# Altium project Payload Board.PrjPcb
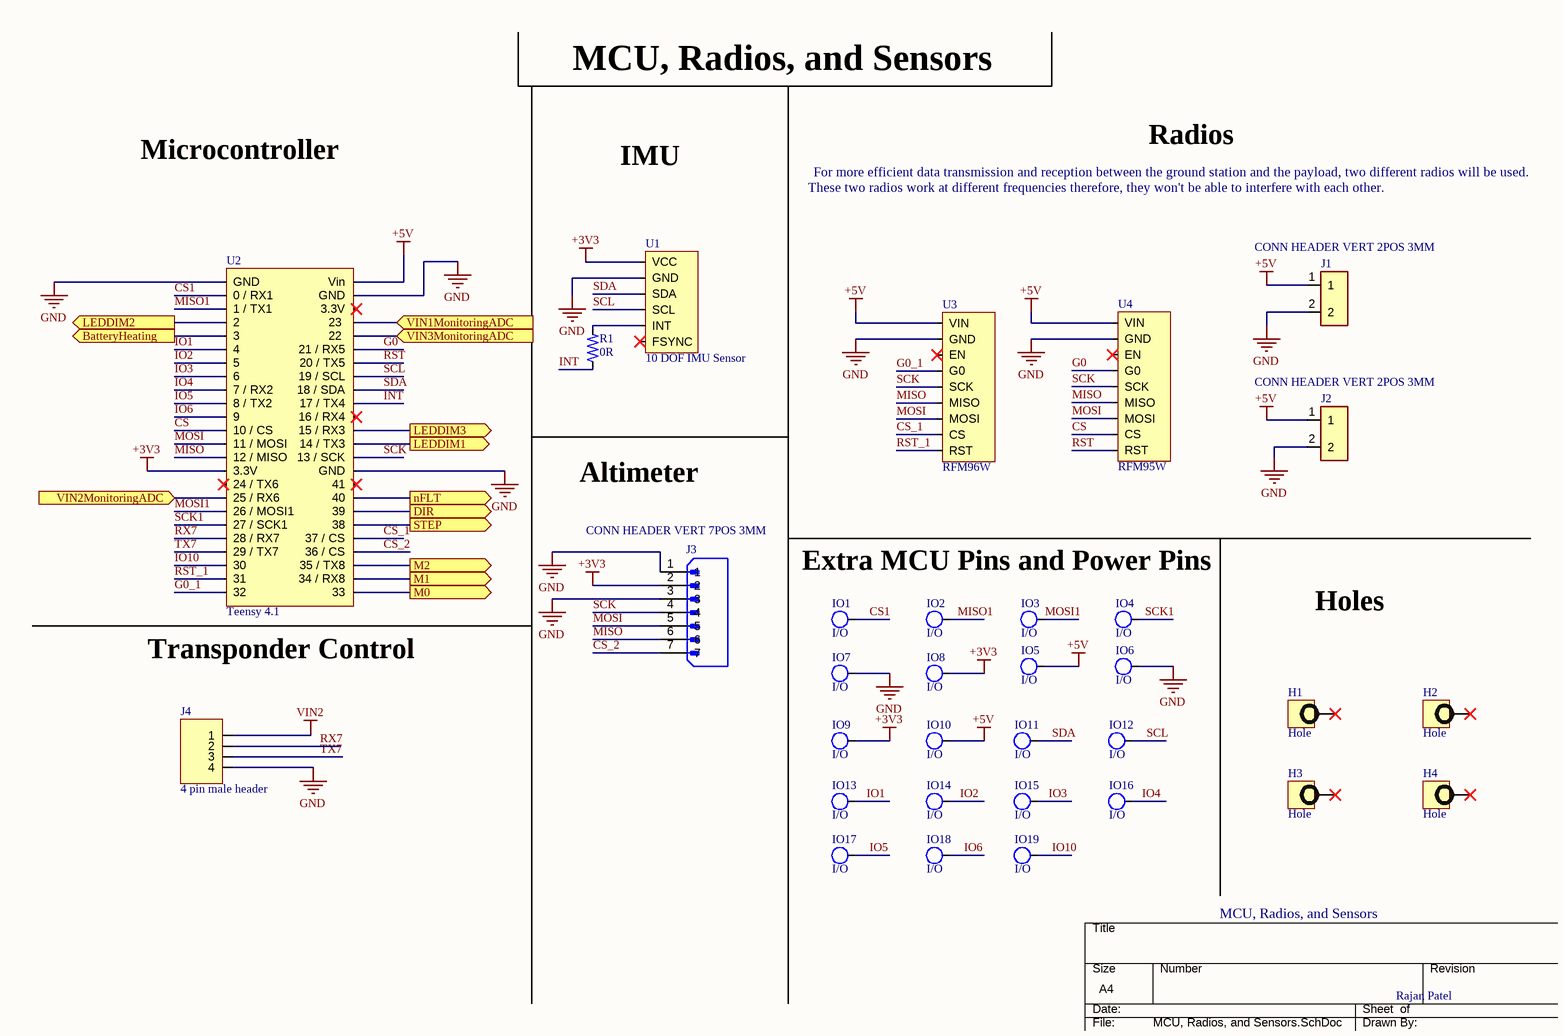
[diagram p0: MCU, Radios, and Sensors.SchDoc]
3 sheets, 75 parts. Net scope: flat (ports and power ports of the same name join across sheets).
Board file: Payload_PCB.PcbDoc
Sheets:
  MCU, Radios, and Sensors.SchDoc
  Battery Heating System.SchDoc
  Power Management.SchDoc

## Sheet MCU, Radios, and Sensors.SchDoc: MCU, Radios, and Sensors
size A4; SheetNumber: 1; SheetTotal: 4

### Parts
H1  Hole  [M3 Holes]
H2  Hole  [M3 Holes]
H3  Hole  [M3 Holes]
H4  Hole  [M3 Holes]
IO1  I/O  [Pins]
IO2  I/O  [Pins]
IO3  I/O  [Pins]
IO4  I/O  [Pins]
IO5  I/O  [Pins]
IO6  I/O  [Pins]
IO7  I/O  [Pins]
IO8  I/O  [Pins]
IO9  I/O  [Pins]
IO10  I/O  [Pins]
IO11  I/O  [Pins]
IO12  I/O  [Pins]
IO13  I/O  [Pins]
IO14  I/O  [Pins]
IO15  I/O  [Pins]
IO16  I/O  [Pins]
IO17  I/O  [Pins]
IO18  I/O  [Pins]
IO19  I/O  [Pins]
J1  CONN HEADER VERT 2POS 3MM  [CONN HEADER VERT 2POS 3MM]
J2  CONN HEADER VERT 2POS 3MM  [CONN HEADER VERT 2POS 3MM]
J3  CONN HEADER VERT 7POS 3MM  [MOLEX_436500728]
J4  4 pin male header  [4 Pin Male Header]
R1  0R  [res 0805]
U1  10 DOF IMU Sensor  [10 DOF IMU Sensor]
U2  Teensy 4.1  [Teensy 4.1]
U3  RFM96W  [RFM95W]
U4  RFM95W  [RFM95W]

### Ports
BatteryHeating (out, see Battery Heating System[2B]), DIR (out, see LEDs, and Motors[3B]), LEDDIM1 (out, see LEDs, and Motors[1B]), LEDDIM2 (out, see LEDs, and Motors[2B]), LEDDIM3 (out, see LEDs, and Motors[1C]), M0 (out, see LEDs, and Motors[3B]), M1 (out, see LEDs, and Motors[3B]), M2 (out, see LEDs, and Motors[3B]), nFLT (out, see LEDs, and Motors[3B]), STEP (out, see LEDs, and Motors[3B]), VIN1MonitoringADC (in, see Power Management[1B]), VIN2MonitoringADC (in, see Power Management[3B]), VIN3MonitoringADC (in, see Power Management[4C])

### Nets
+3V3: IO8.1 IO9.1 J3.2 U1.1(VCC) U2.15(3.3V)
+5V: IO5.1 IO10.1 J1.1 J2.1 U2.48(Vin) U3.1(VIN) U4.1(VIN)
GND: IO6.1 IO7.1 J1.2 J2.2 J3.1 J3.3 J4.4 U1.2(GND) U2.1(GND) U2.34(GND) U2.47(GND) U3.2(GND) U4.2(GND)
VIN2: J4.1
CS: U2.12(10_/_CS) U4.8(CS)
CS1: IO1.1 U2.2(0_/_RX1)
CS_1: U2.29(37_/_CS) U3.8(CS)
CS_2: J3.7 U2.28(36_/_CS)
G0: U2.43(21_/_RX5) U4.4(G0)
G0_1: U2.24(32) U3.4(G0)
INT: R1.1 U2.39(17_/_TX4)
IO1: IO13.1 U2.6(4)
IO2: IO14.1 U2.7(5)
IO3: IO15.1 U2.8(6)
IO4: IO16.1 U2.9(7_/_RX2)
IO5: IO17.1 U2.10(8_/_TX2)
IO6: IO18.1 U2.11(9)
IO10: IO19.1 U2.22(30)
MISO: J3.6 U2.14(12_/_MISO) U3.6(MISO) U4.6(MISO)
MISO1: IO2.1 U2.3(1_/_TX1)
MOSI: J3.5 U2.13(11_/_MOSI) U3.7(MOSI) U4.7(MOSI)
MOSI1: IO3.1 U2.18(26_/_MOSI1)
RST: U2.42(20_/_TX5) U4.9(RST)
RST_1: U2.23(31) U3.9(RST)
RX7: J4.2 U2.20(28_/_RX7)
SCK: J3.4 U2.35(13_/_SCK) U3.5(SCK) U4.5(SCK)
SCK1: IO4.1 U2.19(27_/_SCK1)
SCL: IO12.1 U1.4(SCL) U2.41(19_/_SCL)
SDA: IO11.1 U1.3(SDA) U2.40(18_/_SDA)
TX7: J4.3 U2.21(29_/_TX7)
NetR1_2: R1.2 U1.5(INT)
NetR4_2: U2.5(3) ; port BatteryHeating
NetR6_1: U2.45(23) ; port VIN1MonitoringADC
NetR11_1: U2.17(25_/_RX6) ; port VIN2MonitoringADC
NetR17_2: U2.44(22) ; port VIN3MonitoringADC
NetU2_4: U2.4(2) ; port LEDDIM2
NetU2_25: U2.25(33) ; port M0
NetU2_26: U2.26(34_/_RX8) ; port M1
NetU2_27: U2.27(35_/_TX8) ; port M2
NetU2_30: U2.30(38) ; port STEP
NetU2_31: U2.31(39) ; port DIR
NetU2_32: U2.32(40) ; port nFLT
NetU2_36: U2.36(14_/_TX3) ; port LEDDIM1
NetU2_37: U2.37(15_/_RX3) ; port LEDDIM3

Not connected (* = marked no-connect by the designer): H1 1(TERMINAL)*; H2 1(TERMINAL)*; H3 1(TERMINAL)*; H4 1(TERMINAL)*; U1 6(FSYNC)*; U2 16(24_/_TX6)* 33(41)* 38(16_/_RX4)* 46(3.3V)*; U3 3(EN)*; U4 3(EN)*

### Notes on the sheet
- MCU, Radios, and Sensors
- Microcontroller
- IMU
- For more efficient data transmission and reception between the ground station and the payload, two different radios will be used.
- Radios
- These two radios work at different frequencies therefore, they won't be able to interfere with each other.
- Altimeter
- Extra MCU Pins and Power Pins
- Holes
- (near U2) Transponder Control
- Rajan Patel

### Library data of the parts
J1 J2 = 0436500228: Rectangular Power Connector, 2 Contact(s), Female, Solder Terminal; Manufacturer Part Number: 43650-0228; Manufacturer Series: 43650; MF: Molex; MP: 0436500200; Connector Type: Power,Rectangular; Number of Contacts: 2; Option: General Purpose; Contact Style: SQ PIN-SKT; Durability: 30Cycles; Empty Shell: No; Mating Information: MULTIPLE MATING PARTS AVAILABLE; Number Of Connectors: 1; Rated Current (Signal): 5A; Board Mounting Option: PEG; Body/Shell Style: RECEPTACLE; Contact Resistance: 10mR; Dielectric Withstanding Voltage (AC): 1.5kV; Insertion Force-Max: 8.0064N; Insulation Resistance: 1GR; Polarization Key: POLARIZED HOUSING; Withdrawl Force-Min: 3.614N; Mating Contact Pitch: 0.118inch; Mounting Option 1: POLARIZED LCK; Mounting Option 2: LOCKING; Plating Thickness: 15uin; Body Breadth: 0.219inch; Body Depth: 0.39inch; Body Length: 0.38inch; Reference Standard: UL; Reliability: COMMERCIAL; SnapEDA_Link: https://www.snapeda.com/parts/0436500200/Molex/view-part/552556/?ref=snap; Price: None; Availability: Unavailable; Package: None; Value: *; Supplier: Mouser; Supplier Part Number: 538-43650-0228; Manufacturer: Molex; RoHS: Yes; Category: Headers and Wire Housings; Stock: 12783; Pricing: 1=0.78, 10=0.537, 50=0.537, 100=0.537, 1000=0.536, 10000=0.473 (USD); Mounting Technology: Board; Contact Finish - Mating: AU; Insulation Color: Black; Insulation Material: Polymer; Shell Material: Polymer; Contact Material: Brass; Contact Finish - Termination: TIN/LEAD OVER NICKEL; Min Operating Temperature: -40°C; Max Operating Temperature: 105°C; Contact Gender: Male; Termination: Solder; Contact Pattern: RECTANGULAR; Filter Feature: No; Mixed Contacts: No; Mounting Style: STRAIGHT; Number of Rows Loaded: 1; Number Of PCB Rows: 1; PCB Contact Pattern: RECTANGULAR; Terminal Length: 0.125inch; Terminal Pitch: 2.9972mm; Flammability Rating: UL94 V-0; Reach SVHC Compliant: Yes; RoHS Compliant: Yes; DIN Conformance: No; IEC Conformance: No; MIL Conformance: No; ComponentLink1URL: https://datasheet.ciiva.com:443/pdfs/VipMasterIC/IC/MOLE/MOLES07498/MOLES07498-1.pdf?src-supplier=IHS+Markit; ComponentLink1Description: https://datasheet.ciiva.com:443/pdfs/VipMasterIC/IC/MOLE/MOLES07498/MOLES07498-1.pdf?src-supplier=IHS+Markit; ComponentLink2URL: https://datasheet.ciiva.com/13550/0436500228-pcb-headers-148884-13550297.pdf?src-supplier=Mouser; ComponentLink2Description: https://datasheet.ciiva.com/13550/0436500228-pcb-headers-148884-13550297.pdf?src-supplier=Mouser
J3 = 436500728: Connector Header Through Hole 7 position 0.118 (3.00mm); MF: Molex; SnapEDA_Link: https://www.snapeda.com/parts/436500728/Molex/view-part/?ref=snap; Package: None; Value: *; MP: 436500728; Digi-Key_Part_Number: WM10682-ND; Check_prices: https://www.snapeda.com/parts/436500728/Molex/view-part/?ref=eda
R1 = Resistor 0805: MP: 2-2176053-2; Resistance: .39; Power_Rating: .25 W; MF: TE Connectivity; Tolerance: 1%; Package: 0805; Value: *; SnapEDA_Link: https://www.snapeda.com/parts/2-2176053-2/TE%20Connectivity/view-part/2214511/?ref=snap; Availability: Unavailable; Price: None; EU_RoHS_Compliance: Compliant with Exemptions
U1 = 10 DOF IMU Sensor: 10 DOF IMU Sensor, ICM20948 Onboard, Low Power, High Precision
U2 = Teensy 4.1: iMXRT1062 Microcontroller Development Board 600MHz CPU 1GB RAM 8MB Flash; Manufacturer: SparkFun; Manufacturer Part Number: DEV-16771; Supplier: Digikey; Supplier Part Number: 1568-DEV-16771-ND; RoHS: No; Category: Embedded Processors and Controllers; Stock: 2404; Pricing: 1=37.2 (USD); ComponentLink1URL: https://media.digikey.com/pdf/Data%20Sheets/Sparkfun%20PDFs/DEV-16771_Web.pdf?src-supplier=Digikey; ComponentLink1Description: https://media.digikey.com/pdf/Data%20Sheets/Sparkfun%20PDFs/DEV-16771_Web.pdf?src-supplier=Digikey
U3 = RFM96W: Banana Plug; Female to Multi-Stacking Banana Plug; Nickel Plated Brass; Manufacturer: Adafruit Industries; Manufacturer Part Number: 3072; Supplier: Digikey; Supplier Part Number: 1528-1667-ND; RoHS: No; Category: RF Semiconductors and Devices; Stock: 109; Pricing: 1=19.95 (USD); ComponentLink1URL: https://learn.adafruit.com/downloads/pdf/adafruit-rfm69hcw-and-rfm96-rfm95-rfm98-lora-packet-padio-breakouts.pdf?src-supplier=Digikey; ComponentLink1Description: https://learn.adafruit.com/downloads/pdf/adafruit-rfm69hcw-and-rfm96-rfm95-rfm98-lora-packet-padio-breakouts.pdf?src-supplier=Digikey
U4 = RFM95W: Adafruit RFM95W LoRa Radio Transceiver Breakout - 868 or 915 MHz; Manufacturer: Adafruit Industries; Manufacturer Part Number: 3072; Supplier: Digikey; Supplier Part Number: 1528-1667-ND; RoHS: No; Category: RF Semiconductors and Devices; Stock: 109; Pricing: 1=19.95 (USD); ComponentLink1URL: https://learn.adafruit.com/downloads/pdf/adafruit-rfm69hcw-and-rfm96-rfm95-rfm98-lora-packet-padio-breakouts.pdf?src-supplier=Digikey; ComponentLink1Description: https://learn.adafruit.com/downloads/pdf/adafruit-rfm69hcw-and-rfm96-rfm95-rfm98-lora-packet-padio-breakouts.pdf?src-supplier=Digikey

## Sheet Battery Heating System.SchDoc
size A4; SheetNumber: 2; SheetTotal: 4
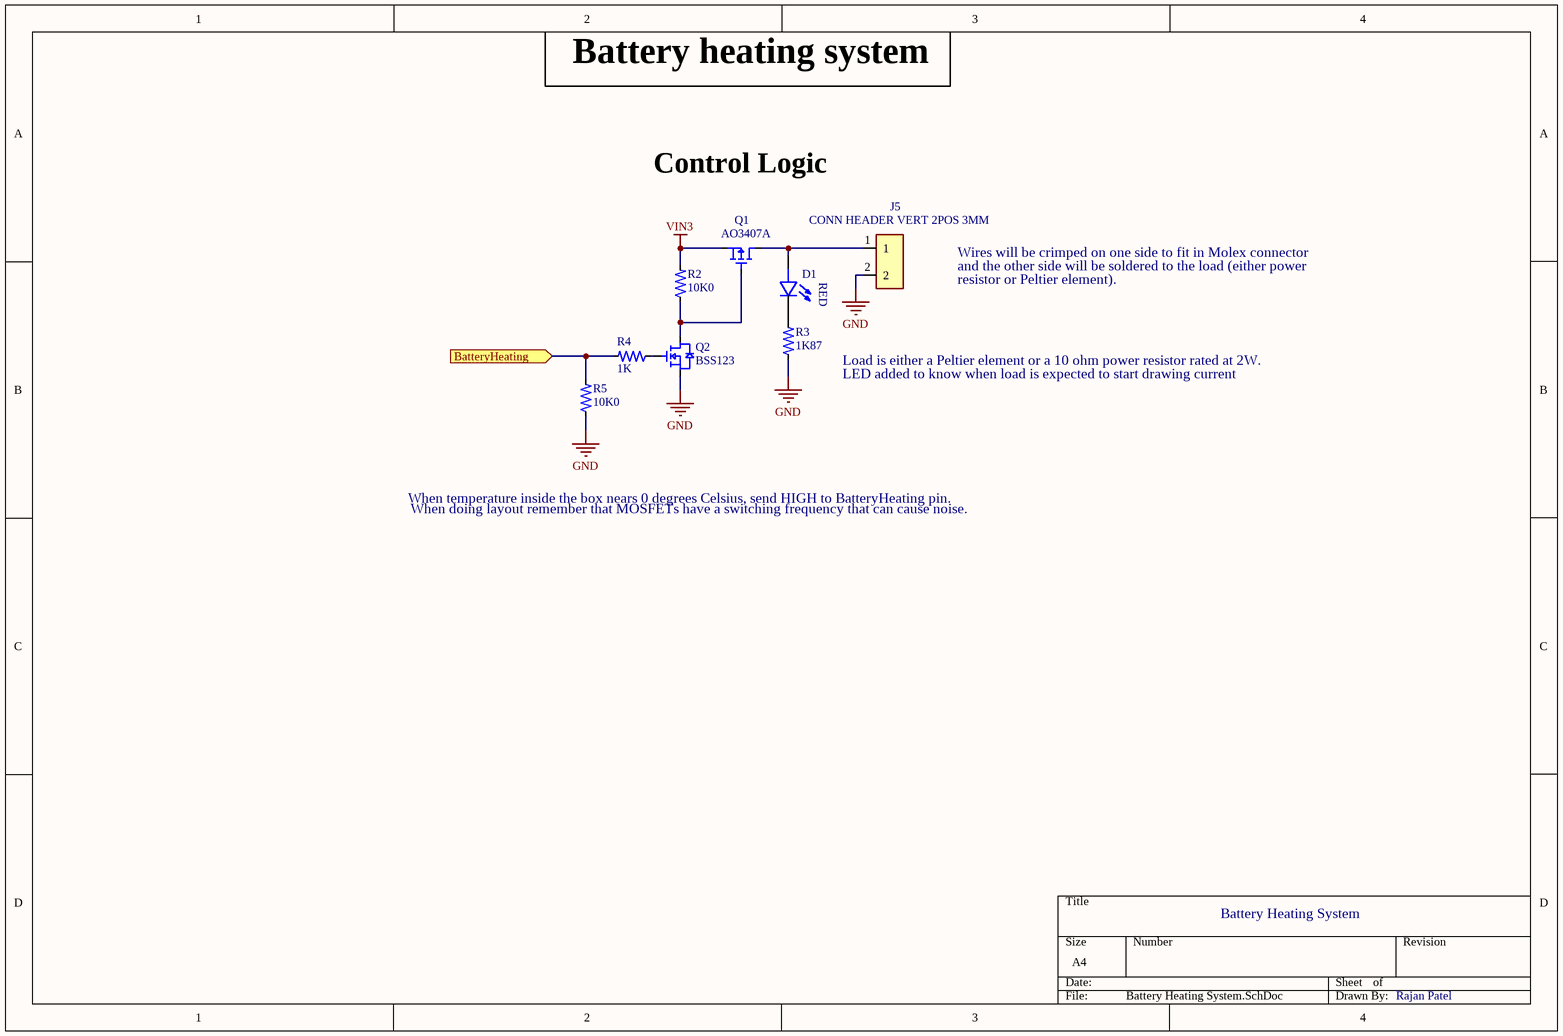
[diagram p1: Battery Heating System.SchDoc]

### Parts
D1  LED 0805  [LED_0805]  (value not drawn)
J5  CONN HEADER VERT 2POS 3MM  [CONN HEADER VERT 2POS 3MM]
Q1  AO3407A  [AO3407A]
Q2  BSS123  [BSS123]
R2  10K0  [res 0805]
R3  1K87  [res 0805]
R4  1K  [res 0805]
R5  10K0  [res 0805]

### Ports
BatteryHeating (in, see MCU, Radios, and Sensors[4C])

### Nets
GND: J5.2 Q2.2(Source) R3.1 R5.1
VIN3: Q1.2(Source) R2.2
NetD1_1: D1.1(C) R3.2
NetD1_2: D1.2(A) J5.1 Q1.3(Drain)
NetQ1_1: Q1.1(Gate) Q2.3(Drain) R2.1
NetQ2_1: Q2.1(Gate) R4.1
NetR4_2: R4.2 R5.2 ; port BatteryHeating

### Notes on the sheet
- Battery heating system
- Control Logic
- Wires will be crimped on one side to fit in Molex connector
- and the other side will be soldered to the load (either power
- resistor or Peltier element).
- Load is either a Peltier element or a 10 ohm power resistor rated at 2W.
- LED added to know when load is expected to start drawing current
- When doing layout remember that MOSFETs have a switching frequency that can cause noise.
- When temperature inside the box nears 0 degrees Celsius, send HIGH to BatteryHeating pin.
- Battery Heating System
- Rajan Patel
- (in symbol LED 0805) RED

### Library data of the parts
D1 = LED 0805: Red LED Indication - Discrete 1.7V 0805 (2012 Metric); MP: 7012X1; Package: None; Availability: Unavailable; Value: *; Price: None
J5 = 0436500228: as J1 on sheet MCU, Radios, and Sensors; SnapEDA_Link: https://www.snapeda.com/parts/0436500200/Molex/view-part/552556/?ref=snap; Price: None; Availability: Unavailable; Package: None; Value: *; Supplier: Mouser; Supplier Part Number: 538-43650-0228; Manufacturer: Molex; RoHS: Yes; Category: Headers and Wire Housings; Stock: 12783; Pricing: 1=0.78, 10=0.537, 50=0.537, 100=0.537, 1000=0.536, 10000=0.473 (USD); Mounting Technology: Board; Contact Finish - Mating: AU; Insulation Color: Black; Insulation Material: Polymer; Shell Material: Polymer; Contact Material: Brass; Contact Finish - Termination: TIN/LEAD OVER NICKEL; Min Operating Temperature: -40°C; Max Operating Temperature: 105°C; Contact Gender: Male; Termination: Solder; Contact Pattern: RECTANGULAR; Filter Feature: No; Mixed Contacts: No; Mounting Style: STRAIGHT; Number of Rows Loaded: 1; Number Of PCB Rows: 1; PCB Contact Pattern: RECTANGULAR; Terminal Length: 0.125inch; Terminal Pitch: 2.9972mm; Flammability Rating: UL94 V-0; Reach SVHC Compliant: Yes; RoHS Compliant: Yes; DIN Conformance: No; IEC Conformance: No; MIL Conformance: No; ComponentLink1URL: https://datasheet.ciiva.com:443/pdfs/VipMasterIC/IC/MOLE/MOLES07498/MOLES07498-1.pdf?src-supplier=IHS+Markit; ComponentLink1Description: https://datasheet.ciiva.com:443/pdfs/VipMasterIC/IC/MOLE/MOLES07498/MOLES07498-1.pdf?src-supplier=IHS+Markit; ComponentLink2URL: https://datasheet.ciiva.com/13550/0436500228-pcb-headers-148884-13550297.pdf?src-supplier=Mouser; ComponentLink2Description: https://datasheet.ciiva.com/13550/0436500228-pcb-headers-148884-13550297.pdf?src-supplier=Mouser
Q1 = AO3407A: Small Signal Field-Effect Transistor, 4.3A I(D), 30V, 1-Element, P-Channel, Silicon, Metal-oxide Semiconductor FET; Manufacturer: Alpha & Omega Semiconductor; Package Body Material: Plastic; Drain-source On Resistance-Max: 48mR; Feedback Cap-Max (Crss): 90pF; Number of Elements: 1; Operating Mode: ENHANCEMENT MODE; Power Dissipation-Max (Abs): 1.4W; Transistor Application: SWITCHING; Qualification Status: Not Qualified; Supplier: Digikey; Supplier Part Number: 785-1006-1-ND; Manufacturer Part Number: AO3407A; RoHS: Yes; Category: MOSFETs; Stock: 856157; Pricing: 1=0.31, 10=0.22, 100=0.1112, 500=0.09854, 1000=0.07668 (USD); Pins: 3; Package Shape: Rectangular; Terminal Finish: Tin; Transistor Element Material: SILICON; Max Operating Temperature: 150°C; JESD-609 Code: e3; Polarity/Channel Type: P-CHANNEL; Drain Current-Max (Abs) (ID): 4.3A; Drain Current-Max (ID): 4.3A; DS Breakdown Voltage-Min: 30V; FET Technology: METAL-OXIDE SEMICONDUCTOR; JESD-30 Code: R-PDSO-G3; Moisture Sensitivity Level: 1; Package Style: SMALL OUTLINEMeter; Surface Mount: Yes; Terminal Form: Gull Wing; Terminal Position: DUAL; RoHS Compliant: Yes; Reach SVHC Compliant: Yes; ComponentLink1URL: https://datasheet.ciiva.com:443/pdfs/VipMasterIC/IC/ALOM/ALOMS01464/ALOMS01464-1.pdf?src-supplier=IHS+Markit; ComponentLink1Description: https://datasheet.ciiva.com:443/pdfs/VipMasterIC/IC/ALOM/ALOMS01464/ALOMS01464-1.pdf?src-supplier=IHS+Markit; ComponentLink2URL: https://datasheet.ciiva.com/940/ao3407a-940745.pdf?src-supplier=Digikey; ComponentLink2Description: https://datasheet.ciiva.com/940/ao3407a-940745.pdf?src-supplier=Digikey; ComponentLink3URL: https://datasheet.ciiva.com/940/ao3407a-940747.pdf?src-supplier=Digikey; ComponentLink3Description: https://datasheet.ciiva.com/940/ao3407a-940747.pdf?src-supplier=Digikey; ComponentLink4URL: https://datasheet.ciiva.com/18057/getdatasheetpartid-64436-18057110.pdf?src-supplier=Verical; ComponentLink4Description: https://datasheet.ciiva.com/18057/getdatasheetpartid-64436-18057110.pdf?src-supplier=Verical
Q2 = BSS123_1: Small Signal Field-Effect Transistor, 0.17A I(D), 100V, 1-Element, N-Channel, Silicon, Metal-oxide Semiconductor FET, TO-236; Manufacturer: ON Semiconductor / Fairchild; Package Body Material: Plastic; Drain Current-Max (ID): 170mA; Drain-source On Resistance-Max: 10R; Number of Elements: 1; Operating Mode: ENHANCEMENT MODE; Feedback Cap-Max (Crss): 6pF; Power Dissipation-Max (Abs): 360mW; Transistor Application: SWITCHING; Qualification Status: Not Qualified; Supplier: Digikey; Supplier Part Number: BSS123NCT-ND; Manufacturer Part Number: BSS123; RoHS: Yes; Category: MOSFETs; Stock: 15036; Pricing: 1=0.35, 10=0.246, 100=0.1244, 500=0.10144, 1000=0.07527 (USD); Pins: 3; Package Shape: Rectangular; Transistor Element Material: SILICON; Max Operating Temperature: 150°C; Polarity/Channel Type: N-CHANNEL; DS Breakdown Voltage-Min: 100V; FET Technology: METAL-OXIDE SEMICONDUCTOR; JESD-30 Code: R-PDSO-G3; Package Style: SMALL OUTLINEMeter; Surface Mount: Yes; Terminal Form: Gull Wing; Terminal Position: DUAL; Moisture Sensitivity Level: 1; Drain Current-Max (Abs) (ID): 170mA; RoHS Compliant: Yes; Reach SVHC Compliant: Yes; ComponentLink1URL: https://datasheet.ciiva.com:443/pdfs/VipMasterIC/IC/ONSM/ONSM-S-A0003158648/ONSM-S-A0003544094-1.pdf?src-supplier=IHS+Markit; ComponentLink1Description: https://datasheet.ciiva.com:443/pdfs/VipMasterIC/IC/ONSM/ONSM-S-A0003158648/ONSM-S-A0003544094-1.pdf?src-supplier=IHS+Markit
R2-R5 = Resistor 0805: as R1 on sheet MCU, Radios, and Sensors; Package: 0805; Value: *; SnapEDA_Link: https://www.snapeda.com/parts/2-2176053-2/TE%20Connectivity/view-part/2214511/?ref=snap; Availability: Unavailable; Price: None; EU_RoHS_Compliance: Compliant with Exemptions

## Sheet Power Management.SchDoc
size A4; SheetNumber: 4; SheetTotal: 4
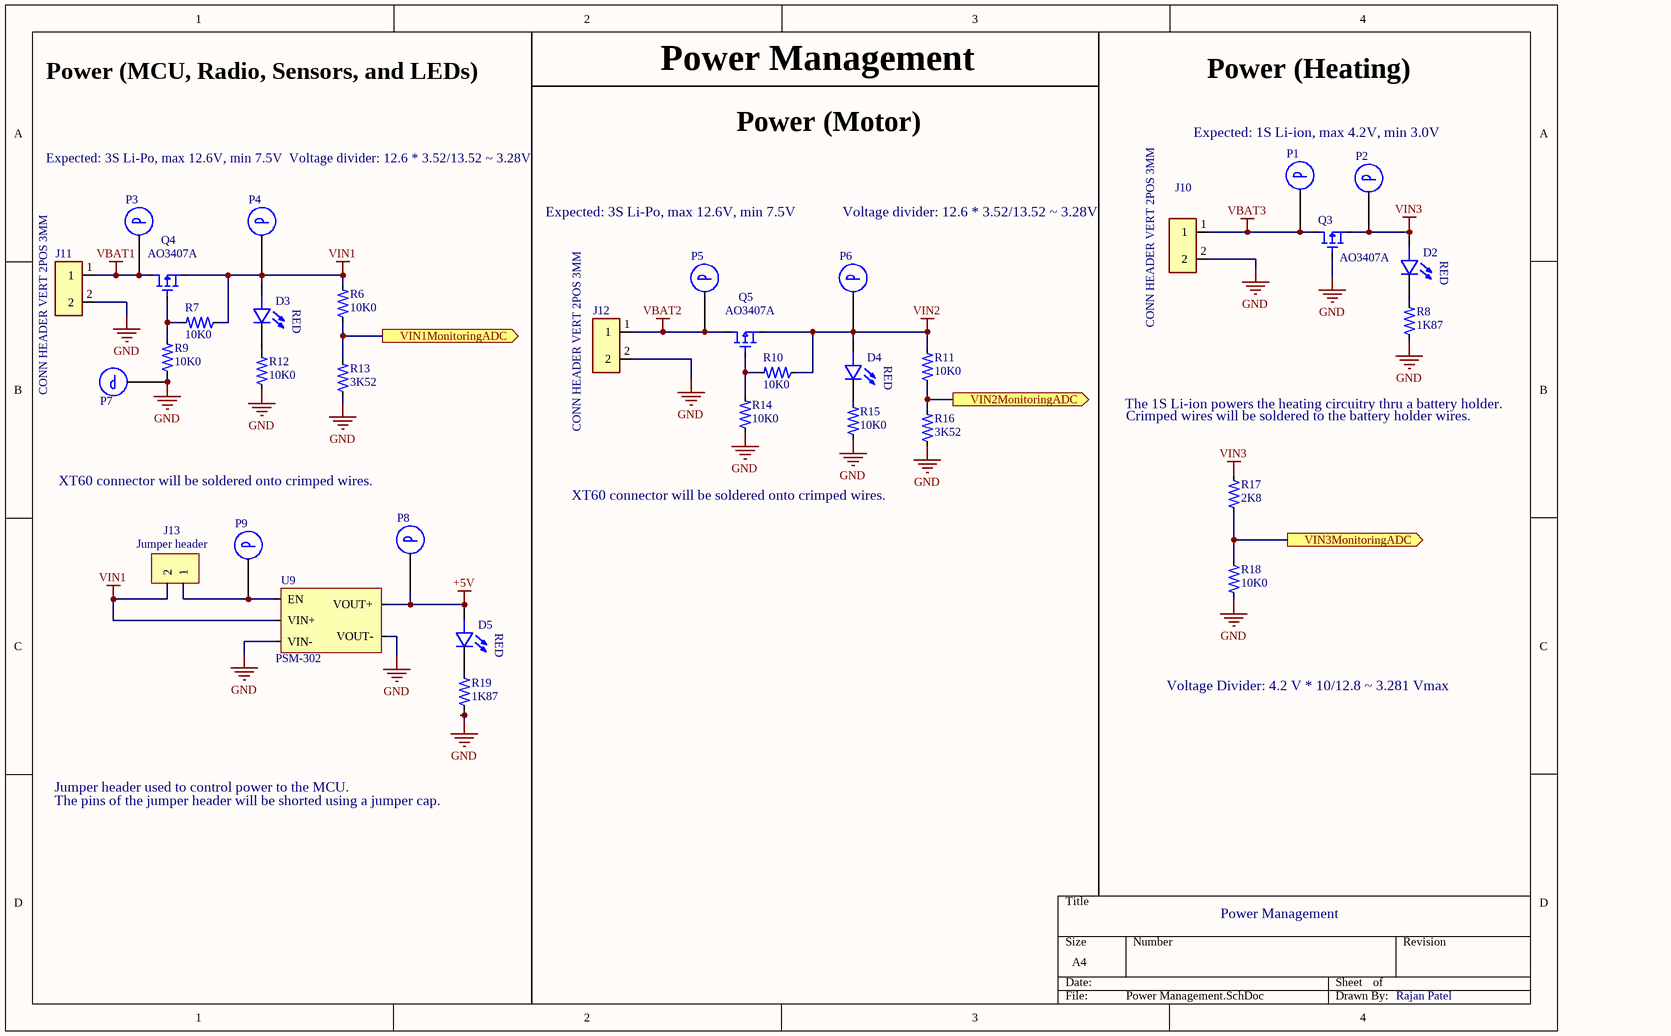
[diagram p2: Power Management.SchDoc]

### Parts
D2  LED 0805  [LED_0805]  (value not drawn)
D3  LED 0805  [LED_0805]  (value not drawn)
D4  LED 0805  [LED_0805]  (value not drawn)
D5  LED 0805  [LED_0805]  (value not drawn)
J10  CONN HEADER VERT 2POS 3MM  [CONN HEADER VERT 2POS 3MM]
J11  CONN HEADER VERT 2POS 3MM  [CONN HEADER VERT 2POS 3MM]
J12  CONN HEADER VERT 2POS 3MM  [CONN HEADER VERT 2POS 3MM]
J13  Jumper header  [2 Pin Male Header]
P1  Probe_5019  [Testpoint]  (value not drawn)
P2  Probe_5019  [Testpoint]  (value not drawn)
P3  Probe_5019  [Testpoint]  (value not drawn)
P4  Probe_5019  [Testpoint]  (value not drawn)
P5  Probe_5019  [Testpoint]  (value not drawn)
P6  Probe_5019  [Testpoint]  (value not drawn)
P7  Probe_5019  [Testpoint]  (value not drawn)
P8  Probe_5019  [Testpoint]  (value not drawn)
P9  Probe_5019  [Testpoint]  (value not drawn)
Q3  AO3407A  [AO3407A]
Q4  AO3407A  [AO3407A]
Q5  AO3407A  [AO3407A]
R6  10K0  [res 0805]
R7  10K0  [res 0805]
R8  1K87  [res 0805]
R9  10K0  [res 0805]
R10  10K0  [res 0805]
R11  10K0  [res 0805]
R12  10K0  [res 0805]
R13  3K52  [res 0805]
R14  10K0  [res 0805]
R15  10K0  [res 0805]
R16  3K52  [res 0805]
R17  2K8  [res 0805]
R18  10K0  [res 0805]
R19  1K87  [res 0805]
U9  PSM-302  [PSM-302]

### Ports
VIN1MonitoringADC (out, see MCU, Radios, and Sensors[3C]), VIN2MonitoringADC (out, see MCU, Radios, and Sensors[4C]), VIN3MonitoringADC (out, see MCU, Radios, and Sensors[3C])

### Nets
+5V: D5.2(A) P8.1 U9.5(VOUT+)
GND: J10.2 J11.2 J12.2 P7.1 Q3.1(Gate) R8.1 R9.1 R12.1 R13.1 R14.1 R15.1 R16.1 R18.2 R19.1 U9.3(VIN-) U9.4(VOUT-)
VBAT1: J11.1 P3.1 Q4.3(Drain)
VBAT2: J12.1 P5.1 Q5.3(Drain)
VBAT3: J10.1 P1.1 Q3.3(Drain)
VIN1: D3.2(A) J13.2 P4.1 Q4.2(Source) R6.2 R7.1 U9.2(VIN+)
VIN2: D4.2(A) P6.1 Q5.2(Source) R10.1 R11.2
VIN3: D2.2(A) P2.1 Q3.2(Source) R17.1
NetD2_1: D2.1(C) R8.2
NetD3_1: D3.1(C) R12.2
NetD4_1: D4.1(C) R15.2
NetD5_1: D5.1(C) R19.2
NetJ13_1: J13.1 P9.1 U9.1(EN)
NetQ4_1: Q4.1(Gate) R7.2 R9.2
NetQ5_1: Q5.1(Gate) R10.2 R14.2
NetR6_1: R6.1 R13.2 ; port VIN1MonitoringADC
NetR11_1: R11.1 R16.2 ; port VIN2MonitoringADC
NetR17_2: R17.2 R18.1 ; port VIN3MonitoringADC

### Notes on the sheet
- Power (MCU, Radio, Sensors, and LEDs)
- Power Management
- Power (Heating)
- Expected: 3S Li-Po, max 12.6V, min 7.5V
- Voltage divider: 12.6 * 3.52/13.52 ~ 3.28V
- Power (Motor)
- Expected: 1S Li-ion, max 4.2V, min 3.0V
- The 1S Li-ion powers the heating circuitry thru a battery holder.
- Crimped wires will be soldered to the battery holder wires.
- XT60 connector will be soldered onto crimped wires.
- Voltage Divider: 4.2 V * 10/12.8 ~ 3.281 Vmax
- Jumper header used to control power to the MCU.
- The pins of the jumper header will be shorted using a jumper cap.
- Rajan Patel
- (in symbol LED 0805) RED

### Library data of the parts
D2-D5 = LED 0805: as D1 on sheet Battery Heating System; Package: None; Availability: Unavailable; Value: *; Price: None
J10-J12 = 0436500228: as J1 on sheet MCU, Radios, and Sensors; SnapEDA_Link: https://www.snapeda.com/parts/0436500200/Molex/view-part/552556/?ref=snap; Price: None; Availability: Unavailable; Package: None; Value: *; Supplier: Mouser; Supplier Part Number: 538-43650-0228; Manufacturer: Molex; RoHS: Yes; Category: Headers and Wire Housings; Stock: 12783; Pricing: 1=0.78, 10=0.537, 50=0.537, 100=0.537, 1000=0.536, 10000=0.473 (USD); Mounting Technology: Board; Contact Finish - Mating: AU; Insulation Color: Black; Insulation Material: Polymer; Shell Material: Polymer; Contact Material: Brass; Contact Finish - Termination: TIN/LEAD OVER NICKEL; Min Operating Temperature: -40°C; Max Operating Temperature: 105°C; Contact Gender: Male; Termination: Solder; Contact Pattern: RECTANGULAR; Filter Feature: No; Mixed Contacts: No; Mounting Style: STRAIGHT; Number of Rows Loaded: 1; Number Of PCB Rows: 1; PCB Contact Pattern: RECTANGULAR; Terminal Length: 0.125inch; Terminal Pitch: 2.9972mm; Flammability Rating: UL94 V-0; Reach SVHC Compliant: Yes; RoHS Compliant: Yes; DIN Conformance: No; IEC Conformance: No; MIL Conformance: No; ComponentLink1URL: https://datasheet.ciiva.com:443/pdfs/VipMasterIC/IC/MOLE/MOLES07498/MOLES07498-1.pdf?src-supplier=IHS+Markit; ComponentLink1Description: https://datasheet.ciiva.com:443/pdfs/VipMasterIC/IC/MOLE/MOLES07498/MOLES07498-1.pdf?src-supplier=IHS+Markit; ComponentLink2URL: https://datasheet.ciiva.com/13550/0436500228-pcb-headers-148884-13550297.pdf?src-supplier=Mouser; ComponentLink2Description: https://datasheet.ciiva.com/13550/0436500228-pcb-headers-148884-13550297.pdf?src-supplier=Mouser
J13 = 2 Pin Male Header: Board Connector, 2 Contact(s), 1 Row(s), Male, Straight, 0.1 inch Pitch, Solder Terminal, Black Insulator, Receptacle; Manufacturer: TE Connectivity; Manufacturer Part Number: 5-146277-2; Option: General Purpose; Contact Pattern: RECTANGULAR; Contact Style: SQ PIN-SKT; Filter Feature: No; Number Of Connectors: 1; Number of Contacts: 2; Body Breadth: 0.092inch; Body Depth: 0.09inch; Body Length: 0.184inch; Plating Thickness: 30uin; Reference Standard: UL; Reliability: COMMERCIAL; Supplier: Digikey; Supplier Part Number: A121371-ND; RoHS: Yes; Category: Connectors; Stock: 17660; Pricing: 1=0.41, 10=0.372, 100=0.3099, 500=0.2634, 1000=0.23087, 5000=0.20608, 10000=0.19176 (USD); Mounting Technology: Board; Contact Finish - Mating: MATTE TIN; Contact Finish - Termination: MATTE TIN; Insulation Color: Black; Insulation Material: Polymer; Connector Type: BOARD CONNECTOR; JESD-609 Code: e3; Body/Shell Style: RECEPTACLE; Contact Gender: Male; Mixed Contacts: No; Mounting Style: STRAIGHT; Number Of PCB Rows: 1; Number of Rows Loaded: 1; PCB Contact Pattern: RECTANGULAR; Termination: Solder; Mating Contact Pitch: 0.1inch; Terminal Length: 0.125inch; Terminal Pitch: 2.54mm; DIN Conformance: No; IEC Conformance: No; MIL Conformance: No; Reach SVHC Compliant: Yes; RoHS Compliant: Yes; ComponentLink1URL: https://datasheet.ciiva.com:443/pdfs/VipMasterIC/IC/TYEL/TYEL-L-A0003497673/TYEL-S-A0000657051-1.pdf?src-supplier=IHS+Markit; ComponentLink1Description: https://datasheet.ciiva.com:443/pdfs/VipMasterIC/IC/TYEL/TYEL-L-A0003497673/TYEL-S-A0000657051-1.pdf?src-supplier=IHS+Markit; ComponentLink2URL: https://datasheet.ciiva.com/22660/1537112-22660377.pdf?src-supplier=Element14; ComponentLink2Description: https://datasheet.ciiva.com/22660/1537112-22660377.pdf?src-supplier=Element14; ComponentLink3URL: https://datasheet.ciiva.com/717/eng-cd-146277-h-146277-1-c-dwg-717333.pdf?src-supplier=Digikey; ComponentLink3Description: https://datasheet.ciiva.com/717/eng-cd-146277-h-146277-1-c-dwg-717333.pdf?src-supplier=Digikey; ComponentLink4URL: https://datasheet.ciiva.com/16426/eng-cd-146277-g2-16426389.pdf?src-supplier=Future+Electronics; ComponentLink4Description: https://datasheet.ciiva.com/16426/eng-cd-146277-g2-16426389.pdf?src-supplier=Future+Electronics; ComponentLink5URL: https://datasheet.ciiva.com/30096/146277-30096236.pdf?src-supplier=Onlinecomponents.com; ComponentLink5Description: https://datasheet.ciiva.com/30096/146277-30096236.pdf?src-supplier=Onlinecomponents.com
P1-P9 = Probe_5019: Phosphor Bronze Contact Miniature Silver Plated Surface Mount Test Points; Manufacturer: Keystone Electronics; Manufacturer Part Number: 5019; Supplier 1: Newark; RoHS: Yes; Category: Connectors; Stock 1: 148000; Pricing 1: 1=0.12300, 1000=0.12300, 2000=0.11700, 4000=0.11300, 6000=0.11000 (USD); Mount: Surface Mount,PCB; Number of Pins: 1; Contact Plating: Silver; Contact Material: Bronze; Material: Bronze; Plating: Silver; Body Material: Bronze; Packaging: Tape and Reel; Package Quantity: 1; Termination: SMD/SMT; Series: 5019; Height: 0.09inch; RoHS Compliant: Yes; Lead Free: Lead Free; Reach SVHC Compliant: Yes; ComponentLink1URL: https://datasheet.ciiva.com/16318/m60-2p61-16318395.pdf?src-supplier=Future+Electronics; ComponentLink1Description: https://datasheet.ciiva.com/16318/m60-2p61-16318395.pdf?src-supplier=Future+Electronics; ComponentLink2URL: https://datasheet.ciiva.com/16885/70182998-16885945.pdf?src-supplier=Allied+Electronics; ComponentLink2Description: https://datasheet.ciiva.com/16885/70182998-16885945.pdf?src-supplier=Allied+Electronics; ComponentLink3URL: https://datasheet.ciiva.com/14848/m60-2p61-14848437.pdf?src-supplier=Digi-Key; ComponentLink3Description: https://datasheet.ciiva.com/14848/m60-2p61-14848437.pdf?src-supplier=Digi-Key; ComponentLink4URL: https://datasheet.ciiva.com/14848/m60-2p61-14848438.pdf?src-supplier=Digi-Key; ComponentLink4Description: https://datasheet.ciiva.com/14848/m60-2p61-14848438.pdf?src-supplier=Digi-Key; ComponentLink5URL: https://datasheet.ciiva.com/14848/m60-2p61-14848439.pdf?src-supplier=Digi-Key; ComponentLink5Description: https://datasheet.ciiva.com/14848/m60-2p61-14848439.pdf?src-supplier=Digi-Key; Supplier Part Number 1: 06W4636
Q3-Q5 = AO3407A: as Q1 on sheet Battery Heating System; Supplier: Digikey; Supplier Part Number: 785-1006-1-ND; Manufacturer Part Number: AO3407A; RoHS: Yes; Category: MOSFETs; Stock: 856157; Pricing: 1=0.31, 10=0.22, 100=0.1112, 500=0.09854, 1000=0.07668 (USD); Pins: 3; Package Shape: Rectangular; Terminal Finish: Tin; Transistor Element Material: SILICON; Max Operating Temperature: 150°C; JESD-609 Code: e3; Polarity/Channel Type: P-CHANNEL; Drain Current-Max (Abs) (ID): 4.3A; Drain Current-Max (ID): 4.3A; DS Breakdown Voltage-Min: 30V; FET Technology: METAL-OXIDE SEMICONDUCTOR; JESD-30 Code: R-PDSO-G3; Moisture Sensitivity Level: 1; Package Style: SMALL OUTLINEMeter; Surface Mount: Yes; Terminal Form: Gull Wing; Terminal Position: DUAL; RoHS Compliant: Yes; Reach SVHC Compliant: Yes; ComponentLink1URL: https://datasheet.ciiva.com:443/pdfs/VipMasterIC/IC/ALOM/ALOMS01464/ALOMS01464-1.pdf?src-supplier=IHS+Markit; ComponentLink1Description: https://datasheet.ciiva.com:443/pdfs/VipMasterIC/IC/ALOM/ALOMS01464/ALOMS01464-1.pdf?src-supplier=IHS+Markit; ComponentLink2URL: https://datasheet.ciiva.com/940/ao3407a-940745.pdf?src-supplier=Digikey; ComponentLink2Description: https://datasheet.ciiva.com/940/ao3407a-940745.pdf?src-supplier=Digikey; ComponentLink3URL: https://datasheet.ciiva.com/940/ao3407a-940747.pdf?src-supplier=Digikey; ComponentLink3Description: https://datasheet.ciiva.com/940/ao3407a-940747.pdf?src-supplier=Digikey; ComponentLink4URL: https://datasheet.ciiva.com/18057/getdatasheetpartid-64436-18057110.pdf?src-supplier=Verical; ComponentLink4Description: https://datasheet.ciiva.com/18057/getdatasheetpartid-64436-18057110.pdf?src-supplier=Verical
R6-R19 = Resistor 0805: as R1 on sheet MCU, Radios, and Sensors; Package: 0805; Value: *; SnapEDA_Link: https://www.snapeda.com/parts/2-2176053-2/TE%20Connectivity/view-part/2214511/?ref=snap; Availability: Unavailable; Price: None; EU_RoHS_Compliance: Compliant with Exemptions
U9 = PSM-302: 3-15VDC to 5VDC Step Down Regulator/Converter Module @ 600mA

## Nets that join several sheets
+5V: MCU, Radios, and Sensors (7 pins), Power Management (D5.2 P8.1 U9.5)
GND: MCU, Radios, and Sensors (13 pins), Battery Heating System (J5.2 Q2.2 R3.1 R5.1), Power Management (16 pins)
VIN2: MCU, Radios, and Sensors (J4.1), Power Management (5 pins)
VIN3: Battery Heating System (Q1.2 R2.2), Power Management (D2.2 P2.1 Q3.2 R17.1)
NetR4_2: MCU, Radios, and Sensors (U2.5), Battery Heating System (R4.2 R5.2)
NetR6_1: MCU, Radios, and Sensors (U2.45), Power Management (R6.1 R13.2)
NetR11_1: MCU, Radios, and Sensors (U2.17), Power Management (R11.1 R16.2)
NetR17_2: MCU, Radios, and Sensors (U2.44), Power Management (R17.2 R18.1)